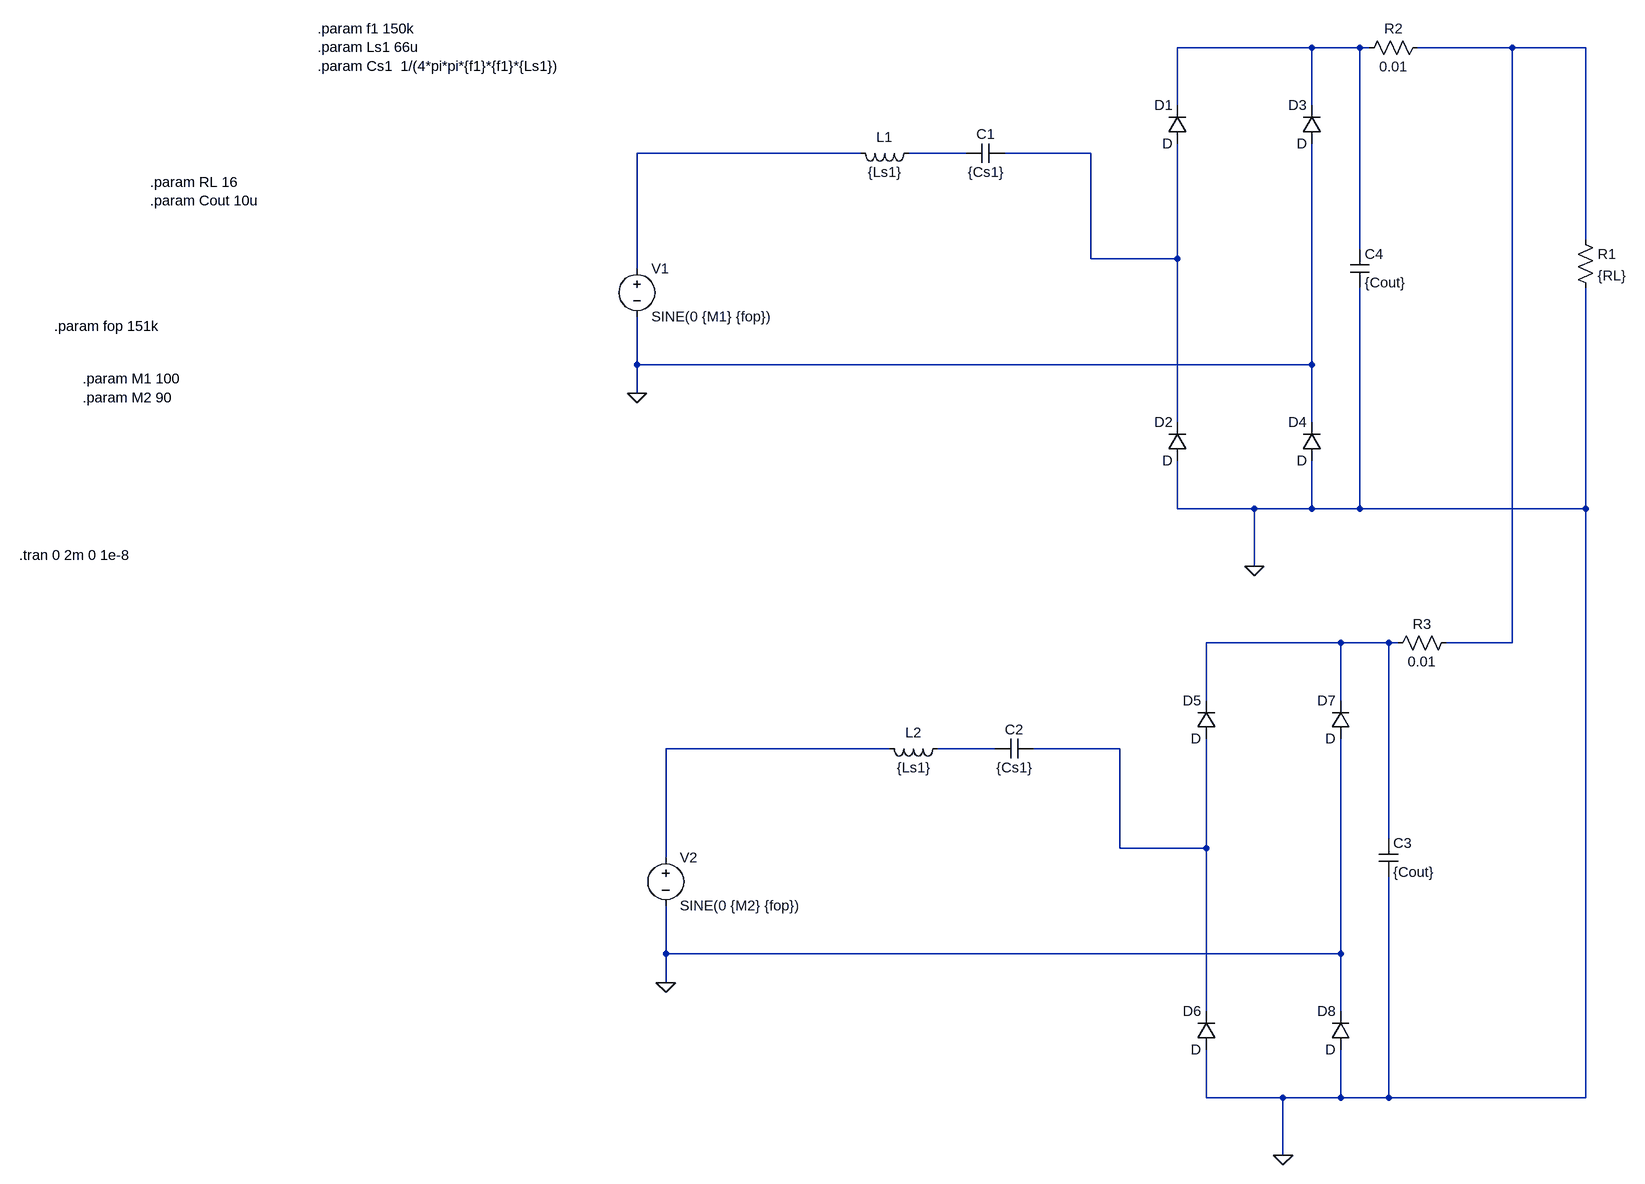
[diagram p0: schematic Draft1.asc]
Draft1.asc, the LTspice schematic file:
Version 4
SHEET 1 2740 1872
WIRE 1936 -240 1712 -240
WIRE 2016 -240 1936 -240
WIRE 2032 -240 2016 -240
WIRE 2432 -240 2112 -240
WIRE 2624 -240 2432 -240
WIRE 1712 -144 1712 -240
WIRE 1936 -144 1936 -240
WIRE 1184 -64 736 -64
WIRE 1360 -64 1264 -64
WIRE 1568 -64 1424 -64
WIRE 2624 80 2624 -240
WIRE 2016 96 2016 -240
WIRE 1568 112 1568 -64
WIRE 1712 112 1712 -80
WIRE 1712 112 1568 112
WIRE 736 128 736 -64
WIRE 736 288 736 208
WIRE 1936 288 1936 -80
WIRE 1936 288 736 288
WIRE 736 336 736 288
WIRE 1712 384 1712 112
WIRE 1936 384 1936 288
WIRE 1712 528 1712 448
WIRE 1840 528 1712 528
WIRE 1936 528 1936 448
WIRE 1936 528 1840 528
WIRE 2016 528 2016 160
WIRE 2016 528 1936 528
WIRE 2624 528 2624 160
WIRE 2624 528 2016 528
WIRE 1840 624 1840 528
WIRE 1984 752 1760 752
WIRE 2064 752 1984 752
WIRE 2080 752 2064 752
WIRE 2432 752 2432 -240
WIRE 2432 752 2160 752
WIRE 1760 848 1760 752
WIRE 1984 848 1984 752
WIRE 1232 928 784 928
WIRE 1408 928 1312 928
WIRE 1616 928 1472 928
WIRE 2064 1088 2064 752
WIRE 1616 1104 1616 928
WIRE 1760 1104 1760 912
WIRE 1760 1104 1616 1104
WIRE 784 1120 784 928
WIRE 784 1280 784 1200
WIRE 1984 1280 1984 912
WIRE 1984 1280 784 1280
WIRE 784 1328 784 1280
WIRE 1760 1376 1760 1104
WIRE 1984 1376 1984 1280
WIRE 1760 1520 1760 1440
WIRE 1888 1520 1760 1520
WIRE 1984 1520 1984 1440
WIRE 1984 1520 1888 1520
WIRE 2064 1520 2064 1152
WIRE 2064 1520 1984 1520
WIRE 2624 1520 2624 528
WIRE 2624 1520 2064 1520
WIRE 1888 1616 1888 1520
FLAG 736 336 0
FLAG 1840 624 0
FLAG 784 1328 0
FLAG 1888 1616 0
SYMBOL voltage 736 112 R0
WINDOW 123 0 0 Left 0
WINDOW 39 0 0 Left 0
SYMATTR InstName V1
SYMATTR Value SINE(0 {M1} {fop})
SYMBOL ind 1280 -80 R90
WINDOW 0 5 56 VBottom 2
WINDOW 3 32 56 VTop 2
SYMATTR InstName L1
SYMATTR Value {Ls1}
SYMBOL cap 1424 -80 R90
WINDOW 0 0 32 VBottom 2
WINDOW 3 32 32 VTop 2
SYMATTR InstName C1
SYMATTR Value {Cs1}
SYMBOL diode 1728 -80 R180
WINDOW 0 24 64 Left 2
WINDOW 3 24 0 Left 2
SYMATTR InstName D1
SYMBOL diode 1728 448 R180
WINDOW 0 24 64 Left 2
WINDOW 3 24 0 Left 2
SYMATTR InstName D2
SYMBOL diode 1952 -80 R180
WINDOW 0 24 64 Left 2
WINDOW 3 24 0 Left 2
SYMATTR InstName D3
SYMBOL diode 1952 448 R180
WINDOW 0 24 64 Left 2
WINDOW 3 24 0 Left 2
SYMATTR InstName D4
SYMBOL res 2608 64 R0
SYMATTR InstName R1
SYMATTR Value {RL}
SYMBOL cap 2000 96 R0
SYMATTR InstName C4
SYMATTR Value {Cout}
SYMBOL res 2128 -256 R90
WINDOW 0 0 56 VBottom 2
WINDOW 3 32 56 VTop 2
SYMATTR InstName R2
SYMATTR Value 0.01
SYMBOL voltage 784 1104 R0
WINDOW 123 0 0 Left 0
WINDOW 39 0 0 Left 0
SYMATTR InstName V2
SYMATTR Value SINE(0 {M2} {fop})
SYMBOL ind 1328 912 R90
WINDOW 0 5 56 VBottom 2
WINDOW 3 32 56 VTop 2
SYMATTR InstName L2
SYMATTR Value {Ls1}
SYMBOL cap 1472 912 R90
WINDOW 0 0 32 VBottom 2
WINDOW 3 32 32 VTop 2
SYMATTR InstName C2
SYMATTR Value {Cs1}
SYMBOL diode 1776 912 R180
WINDOW 0 24 64 Left 2
WINDOW 3 24 0 Left 2
SYMATTR InstName D5
SYMBOL diode 1776 1440 R180
WINDOW 0 24 64 Left 2
WINDOW 3 24 0 Left 2
SYMATTR InstName D6
SYMBOL diode 2000 912 R180
WINDOW 0 24 64 Left 2
WINDOW 3 24 0 Left 2
SYMATTR InstName D7
SYMBOL diode 2000 1440 R180
WINDOW 0 24 64 Left 2
WINDOW 3 24 0 Left 2
SYMATTR InstName D8
SYMBOL cap 2048 1088 R0
SYMATTR InstName C3
SYMATTR Value {Cout}
SYMBOL res 2176 736 R90
WINDOW 0 0 56 VBottom 2
WINDOW 3 32 56 VTop 2
SYMATTR InstName R3
SYMATTR Value 0.01
TEXT -208 -272 Left 2 !.param f1 150k\n.param Ls1 66u\n.param Cs1  1/(4*pi*pi*{f1}*{f1}*{Ls1})
TEXT -536 -16 Left 2 !.param RL 16\n.param Cout 10u
TEXT -754 606 Left 2 !.tran 0 2m 0 1e-8
TEXT -648 312 Left 2 !.param M1 100\n.param M2 90
TEXT -696 224 Left 2 !.param fop 151k

The netlist it stands for:
* Draft1.asc
V1 N003 0 SINE(0 {M1} {fop})
L1 N004 N003 {Ls1}
C1 N005 N004 {Cs1}
D1 N005 N001 D
D2 0 N005 D
D3 0 N001 D
D4 0 0 D
R1 N002 0 {RL}
C4 N001 0 {Cout}
R2 N002 N001 0.01
V2 N007 0 SINE(0 {M2} {fop})
L2 N008 N007 {Ls1}
C2 N009 N008 {Cs1}
D5 N009 N006 D
D6 0 N009 D
D7 0 N006 D
D8 0 0 D
C3 N006 0 {Cout}
R3 N002 N006 0.01
.model D D
.lib standard.dio
.param f1 150k
.param Ls1 66u
.param Cs1  1/(4*pi*pi*{f1}*{f1}*{Ls1})
.param RL 16
.param Cout 10u
.tran 0 2m 0 1e-8
.param M1 100
.param M2 90
.param fop 151k
.backanno
.end